# Altium schematic sheet Wideband.SchDoc
size A4
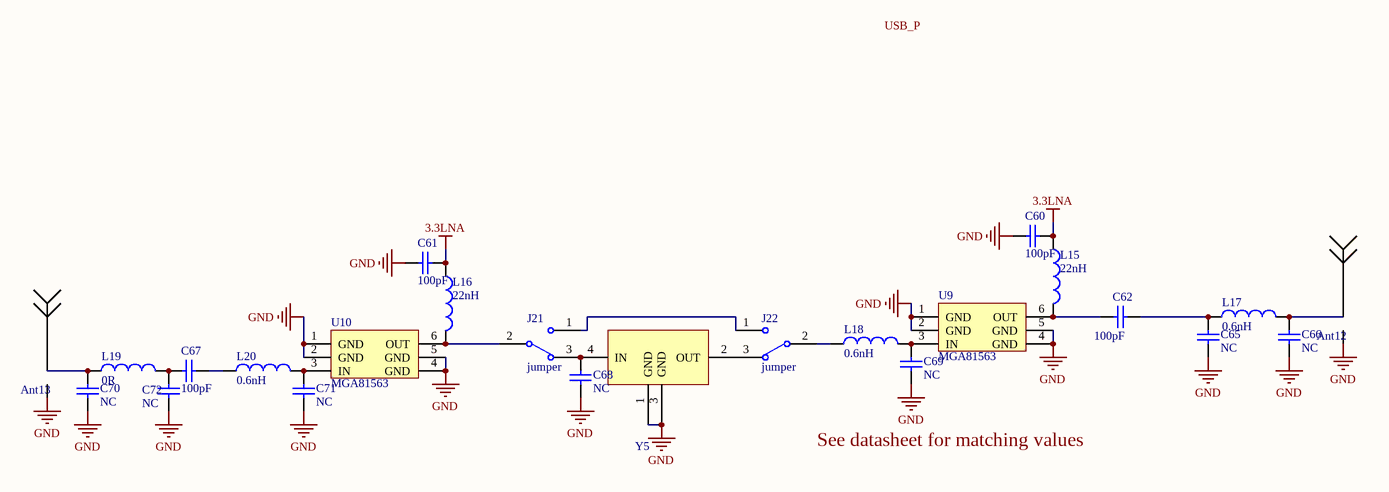
[diagram p0: Wideband.SchDoc]

## Parts
Ant12  Antenna  [SMA-2]  (value not drawn)
Ant13  Antenna  [SMA-2]  (value not drawn)
C60  value 100pF  [0402]  (hidden comment: Cap)
C61  value 100pF  [0402]  (hidden comment: Cap)
C62  value 100pF  [0402]  (hidden comment: Cap)
C65  value NC  [0402]  (hidden comment: Cap)
C66  value NC  [0402]  (hidden comment: Cap)
C67  value 100pF  [0402]  (hidden comment: Cap)
C68  value NC  [0402]  (hidden comment: Cap)
C69  value NC  [0402]  (hidden comment: Cap)
C70  value NC  [0402]  (hidden comment: Cap)
C71  value NC  [0402]  (hidden comment: Cap)
C72  value NC  [0402]  (hidden comment: Cap)
J21  jumper  [0402J]
J22  jumper  [0402J]
L15  value 22nH  [0603]  (hidden comment: Inductor)
L16  value 22nH  [0603]  (hidden comment: Inductor)
L17  value 0.6nH  [0402]  (hidden comment: Inductor)
L18  value 0.6nH  [0402]  (hidden comment: Inductor)
L19  value 0R  [0402]  (hidden comment: Inductor)
L20  value 0.6nH  [0402]  (hidden comment: Inductor)
U9  MGA81563  [SC-70-6]
U10  MGA81563  [SC-70-6]
Y5  2450BP39C100A  [2450BP39C100A]  (value not drawn)

## Nets
3.3LNA: C60.2 C61.2 L15.1 L16.1
GND: Ant12.GND(G) Ant13.GND(G) C60.1 C61.1 C65.1 C66.1 C68.1 C69.1 C70.1 C71.1 C72.1 U9.1(GND) U9.2(GND) U9.4(GND) U9.5(GND) U10.1(GND) U10.2(GND) U10.4(GND) U10.5(GND) Y5.1(GND) Y5.3(GND)
NetAnt12_1: Ant12.1 C66.2 L17.2
NetAnt13_1: Ant13.1 C70.2 L19.1
NetC62_1: C62.1 L15.2 U9.6(OUT)
NetC62_2: C62.2 C65.2 L17.1
NetC67_1: C67.1 C72.2 L19.2
NetC67_2: C67.2 L20.1
NetC68_2: C68.2 J21.3 Y5.4(IN)
NetC69_2: C69.2 L18.2 U9.3(IN)
NetC71_2: C71.2 L20.2 U10.3(IN)
NetJ21_1: J21.1 J22.1
NetJ21_2: J21.2 L16.2 U10.6(OUT)
NetJ22_2: J22.2 L18.1
NetJ22_3: J22.3 Y5.2(OUT)

## Notes on the sheet
- See datasheet for matching values
- Labels drawn without touching a wire or pin: USB_P

## Library data of the parts
C60-C62 C65-C72 = Cap: Capacitor; Published: 8-Jun-2000; LatestRevisionDate: 17-Jul-2002; LatestRevisionNote: Re-released for DXP Platform.; PackageReference: RAD-0.3; Publisher: Altium Limited; PackageDescription: Radial Cap, Thru-Hole; 2 Leads; 0.3 in Pin Spacing
J21 J22 = SW-SPDT: SPDT Subminiature Toggle Switch, Right Angle Mounting, Vertical Actuation; Published: 24-Mar-1999; LatestRevisionDate: 17-Dec-2003; LatestRevisionNote: Schematic revised, PCB Footprint replaced.; DatasheetVersion: 05-Dec-2000; PackageReference: TL36WW15050; Publisher: Altium Limited; PackageDescription: Switch; 4 Leads; ComponentLink1Description: Manufacturer Link; ComponentLink1URL: http://www.apem.com
L15-L20 = Inductor: Code_IEC: 1005; Published: 8-Jun-2000; LatestRevisionDate: 29-May-2009; LatestRevisionNote: IPC-7351 Footprint Added.; PackageReference: 0402-A; Publisher: Altium Limited; PackageDescription: Chip Inductor; Code_JEITA: 0402